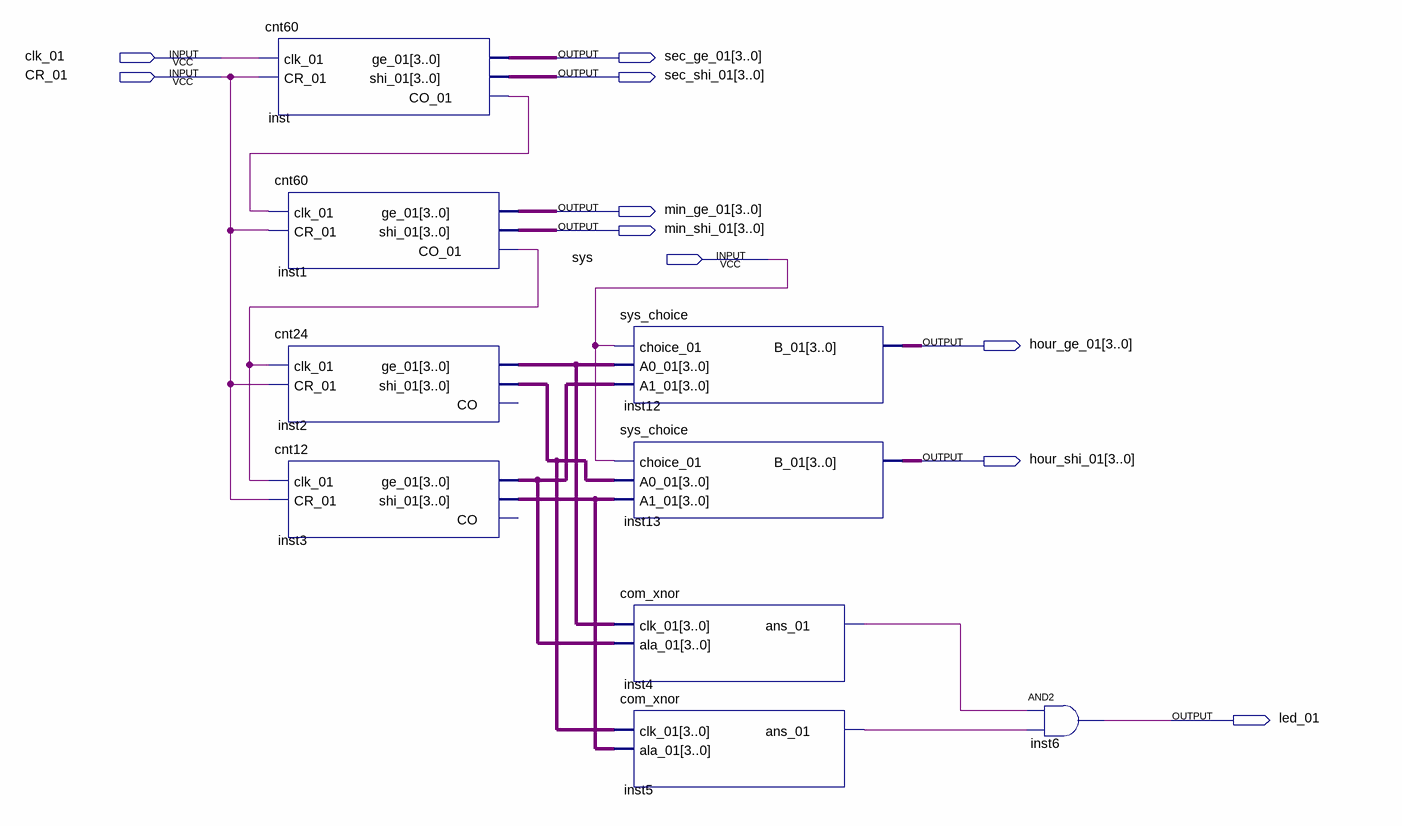
[diagram p0: schematic sheet]
// Quartus schematic time.bdf as structural Verilog: 9 symbols, 10 pins
module \time  (
  input  clk_01,
  input  CR_01,
  input  sys,
  output [3:0] sec_ge_01,
  output [3:0] sec_shi_01,
  output [3:0] min_ge_01,
  output [3:0] min_shi_01,
  output [3:0] hour_ge_01,
  output [3:0] hour_shi_01,
  output led_01
);

  wire inst1_co_01, inst4_ans_01, inst5_ans_01, inst_co_01;
  wire [3:0] inst2_ge_01, inst2_shi_01, inst3_ge_01, inst3_shi_01;

  cnt60 inst (.clk_01(clk_01), .CR_01(CR_01), .ge_01(sec_ge_01), .shi_01(sec_shi_01), .CO_01(inst_co_01));
  cnt60 inst1 (.clk_01(inst_co_01), .CR_01(CR_01), .ge_01(min_ge_01), .shi_01(min_shi_01), .CO_01(inst1_co_01));
  cnt24 inst2 (.clk_01(inst1_co_01), .CR_01(CR_01), .ge_01(inst2_ge_01), .shi_01(inst2_shi_01));  // open: CO
  cnt12 inst3 (.clk_01(inst1_co_01), .CR_01(CR_01), .ge_01(inst3_ge_01), .shi_01(inst3_shi_01));  // open: CO
  sys_choice inst12 (.choice_01(sys), .A0_01(inst2_ge_01), .A1_01(inst3_ge_01), .B_01(hour_ge_01));
  sys_choice inst13 (.choice_01(sys), .A0_01(inst2_shi_01), .A1_01(inst3_shi_01), .B_01(hour_shi_01));
  com_xnor inst4 (.clk_01(inst2_ge_01), .ala_01(inst3_ge_01), .ans_01(inst4_ans_01));
  com_xnor inst5 (.clk_01(inst2_shi_01), .ala_01(inst3_shi_01), .ans_01(inst5_ans_01));
  and inst6 (led_01, inst4_ans_01, inst5_ans_01);
endmodule
